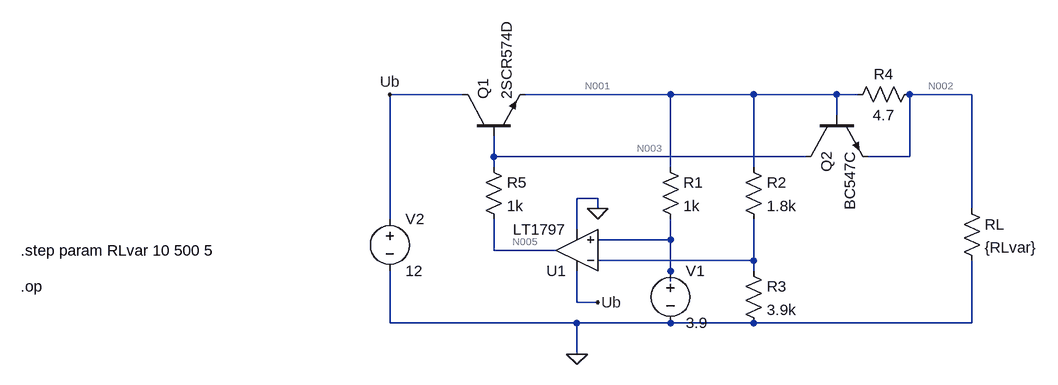
[diagram p0: schematic SerOpTr.asc]
SerOpTr.asc, the LTspice schematic file:
Version 4
SHEET 1 1636 680
WIRE 32 -32 -80 -32
WIRE 352 -32 128 -32
WIRE 480 -32 352 -32
WIRE 608 -32 480 -32
WIRE 640 -32 608 -32
WIRE 816 -32 720 -32
WIRE 608 0 608 -32
WIRE 80 64 80 32
WIRE 560 64 80 64
WIRE 720 64 720 -32
WIRE 720 64 656 64
WIRE 80 80 80 64
WIRE 352 80 352 -32
WIRE 480 80 480 -32
WIRE 240 128 208 128
WIRE 240 144 240 128
WIRE 816 144 816 -32
WIRE -80 160 -80 -32
WIRE 208 176 208 128
WIRE 352 192 352 160
WIRE 352 192 240 192
WIRE 80 208 80 160
WIRE 176 208 80 208
WIRE 480 224 480 160
WIRE 480 224 240 224
WIRE 352 240 352 192
WIRE 480 240 480 224
WIRE 352 256 352 240
WIRE 208 288 208 240
WIRE 240 288 208 288
WIRE -80 320 -80 240
WIRE 208 320 -80 320
WIRE 352 320 208 320
WIRE 480 320 352 320
WIRE 816 320 816 224
WIRE 816 320 480 320
WIRE 208 368 208 320
FLAG 208 368 0
FLAG -80 -32 Ub
FLAG 240 288 Ub
FLAG 240 144 0
SYMBOL Opamps\\LT1797 208 272 R180
SYMATTR InstName U1
SYMBOL voltage -80 144 R0
WINDOW 123 0 0 Left 2
WINDOW 39 0 0 Left 2
SYMATTR InstName V2
SYMATTR Value 12
SYMBOL res 336 64 R0
SYMATTR InstName R1
SYMATTR Value 1k
SYMBOL res 464 64 R0
SYMATTR InstName R2
SYMATTR Value 1.8k
SYMBOL res 464 224 R0
SYMATTR InstName R3
SYMATTR Value 3.9k
SYMBOL npn 32 32 R270
SYMATTR InstName Q1
SYMATTR Value 2SCR574D
SYMBOL res 736 -48 R90
WINDOW 0 0 56 VBottom 2
WINDOW 3 32 56 VTop 2
SYMATTR InstName R4
SYMATTR Value 4.7
SYMBOL npn 560 0 M90
SYMATTR InstName Q2
SYMATTR Value BC547C
SYMBOL res 64 64 R0
SYMATTR InstName R5
SYMATTR Value 1k
SYMBOL res 800 128 R0
SYMATTR InstName RL
SYMATTR Value {RLvar}
SYMBOL voltage 352 224 R0
WINDOW 123 0 0 Left 2
WINDOW 39 0 0 Left 2
SYMATTR InstName V1
SYMATTR Value 3.9
TEXT -648 264 Left 2 !.op
TEXT -648 208 Left 2 !.step param RLvar 10 500 5

The netlist it stands for:
* SerOpTr.asc
XU1 N004 N006 Ub 0 N005 LT1797  ; pins In+ In- V+ V- OUT
V2 Ub 0 12
R1 N001 N004 1k
R2 N001 N006 1.8k
R3 N006 0 3.9k
Q1 Ub N003 N001 0 2SCR574D
R4 N002 N001 4.7
Q2 N003 N001 N002 0 BC547C
R5 N003 N005 1k
RL N002 0 {RLvar}
V1 N004 0 3.9
.model NPN NPN
.model PNP PNP
.lib standard.bjt
.op
.step param RLvar 10 500 5
.backanno
.end

* Results of the author's LTspice run, read from the files saved beside the schematic
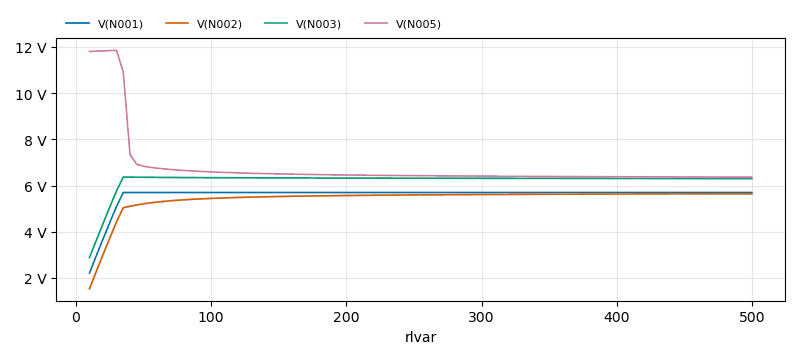
[diagram p1: Operating Point of SerOpTr.asc, plotted from the saved traces]
* Operating Point, 1 run:
*   V(N001): 2.211 V at rlvar=10 , 5.699 V at rlvar=500 , min 2.211 V, max 5.7 V
*   V(N002): 1.53 V at rlvar=10 , 5.646 V at rlvar=500 , min 1.53 V, max 5.646 V
*   V(N003): 2.879 V at rlvar=10 , 6.303 V at rlvar=500 , min 2.879 V, max 6.368 V
*   V(N005): 11.81 V at rlvar=10 , 6.365 V at rlvar=500 , min 6.365 V, max 11.85 V
* From the log:
*   Semiconductor Device Operating Points:
*                           --- Diodes ---
*   Name:    d:u1:3      d:u1:16     d:u1:15     d:u1:14     d:u1:7
*   Model:  u1:dbia2    u1:dbia2     u1:din     u1:dlimp2     u1:dp
*   Id:      1.04e-07    1.04e-07    6.60e-05    1.56e-09    1.00e-04
*   Vd:      9.31e+00    7.00e+00    2.31e+00    2.02e+00    1.20e+01
*   Req:     1.00e-03    1.00e-03    5.00e-05    5.56e-09    1.00e-03
*   CAP:     0.00e+00    0.00e+00    0.00e+00    0.00e+00    0.00e+00
*   Name:    d:u1:13     d:u1:12     d:u1:6      d:u1:11     d:u1:10
*   Model:  u1:dbiaot   u1:dbiaot   u1:dlimn2   u1:dbia1    u1:dbia1
*   Id:     -1.05e-11   -8.18e-12    2.55e-10   -4.65e-08   -3.50e-08
*   Vd:     -1.04e+01   -8.10e+00    3.40e-01   -9.31e+00   -7.00e+00
*   Req:     1.00e-14    1.00e-14    1.25e-09    5.00e-09    5.00e-09
*   CAP:     0.00e+00    0.00e+00    0.00e+00    0.00e+00    0.00e+00
*   Name:    d:u1:8      d:u1:5      d:u1:1      d:u1:4
*   Model:  u1:dlimp1   u1:dlimn1   u1:dvlimu   u1:dbia3
*   Id:      1.13e-07   -2.83e-08    9.02e-03    6.95e-04
*   Vd:      2.02e+00    3.40e-01    1.36e-01    1.10e+00
*   Req:     1.00e-05    1.00e-02    1.00e-01    1.00e-03
*   CAP:     0.00e+00    0.00e+00    0.00e+00    0.00e+00
*                           --- Bipolar Transistors ---
*   Name:       q2          q1
*   Model:    bc547c     2scr574d
*   Ib:       1.91e-05    6.11e-04
*   Ic:       8.32e-03    1.43e-01
*   Vbe:      6.80e-01    6.68e-01
*   Vbc:     -6.68e-01   -9.12e+00
*   Vce:      1.35e+00    9.79e+00
*   BetaDC:   4.36e+02    2.34e+02
*   Gm:       3.01e-01    5.41e+00
*   Rpi:      1.37e+03    4.26e+01
*   Rx:       1.00e+00    1.49e+00
*   Ro:       6.40e+03    7.79e+02
*   Cbe:      1.82e-10    3.50e-09
*   Cbc:      1.82e-12    1.98e-11
*   Cjs:      0.00e+00    0.00e+00
*   BetaAC:   4.13e+02    2.30e+02
*   Cbx:      1.12e-12    0.00e+00
*   Ft:       2.59e+08    2.45e+08
*                           --- VDMOSFET Transistors ---
*   Name:        m:u1:2      m:u1:1
*   Model:        u1:pi       u1:ni
*   Id:         -9.02e-03    8.94e-05
*   Vgs:        -1.88e+00    3.40e-01
*   Vds:        -5.81e-02    1.18e+01
*   Vth:        -3.00e-01    3.00e-01
*   Gm:          5.81e-03    4.47e-03
*   Gds:         1.52e-01    8.00e-07
*   Cgs:         0.00e+00    0.00e+00
*   Cgd:         0.00e+00    0.00e+00
*   Cbody:       0.00e+00    0.00e+00